# EasyEDA Pro project ProPrj_ftdi-jtag-xilinx_2025-03-20_v3.2.epro

# Schematic Schematic1
Board Name: Board1; Create Date: 2024-12-31; Page Name: FT2232HQ; Project Name: ftdi-jtag-xilinx; Schematic Name: Schematic1; Update Date: 2025-03-20; Company: 嘉立创EDA; Page Size: A4; Version: V1.0
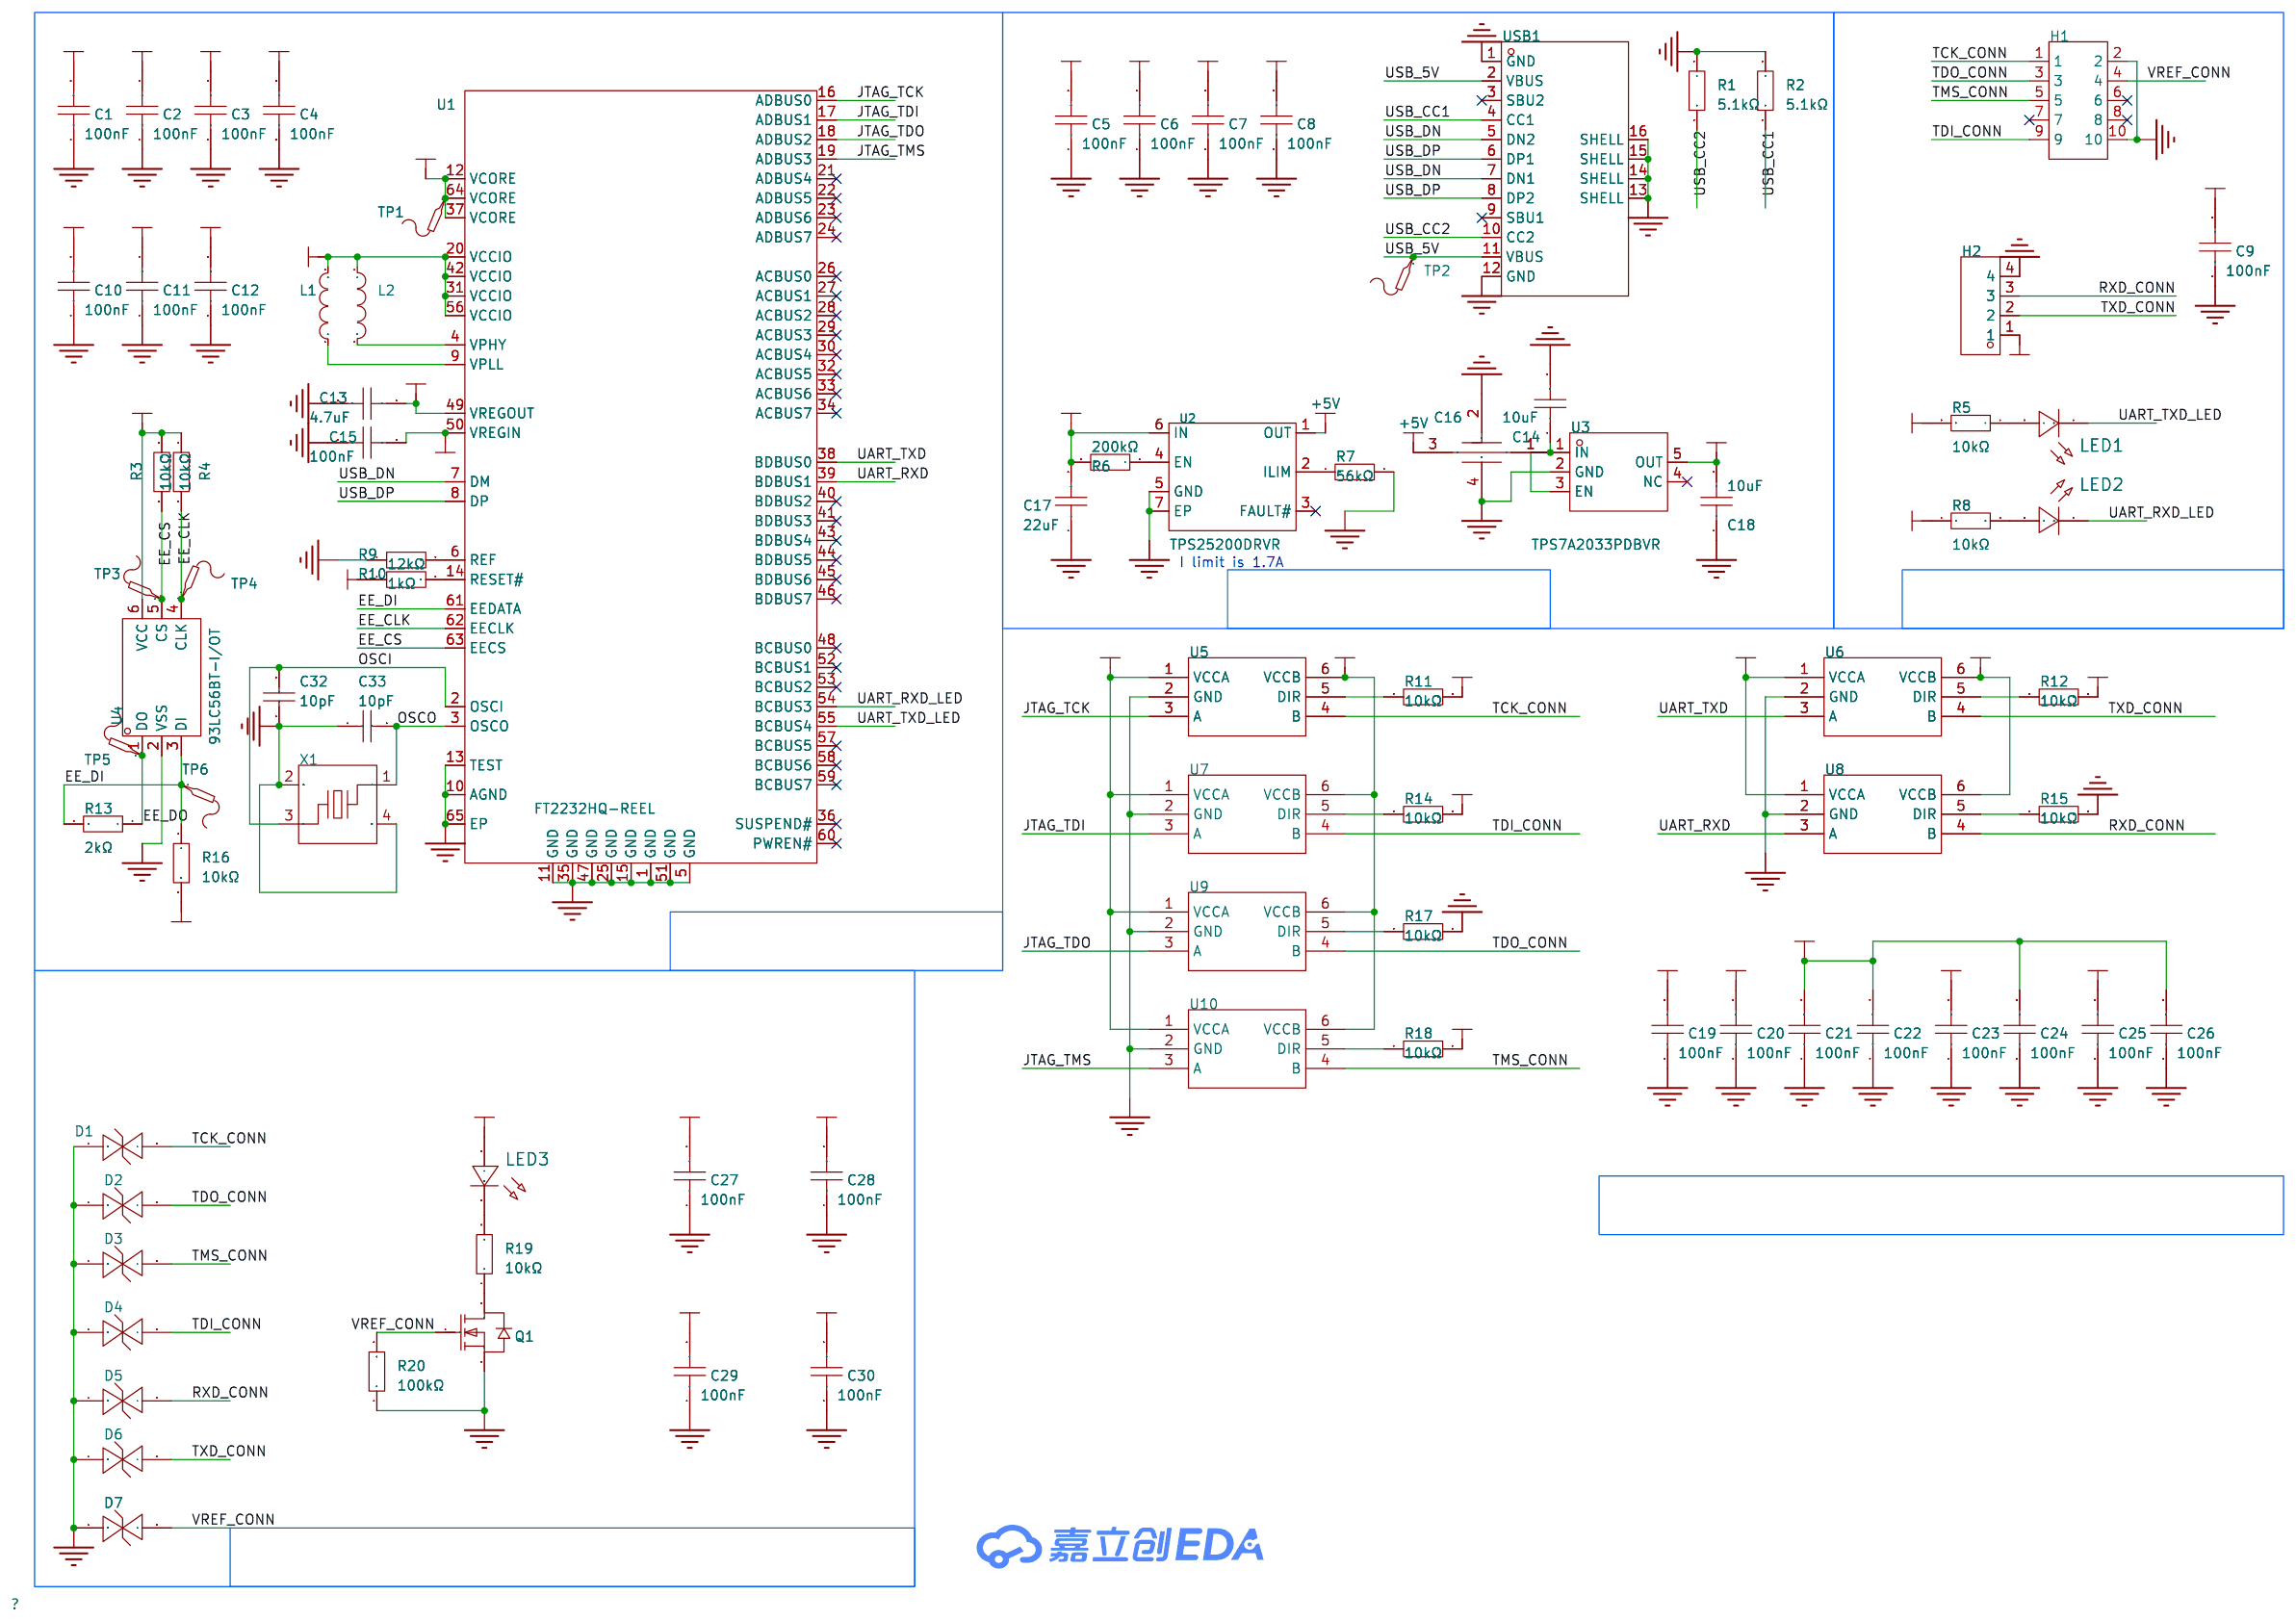
[diagram p0: schematic sheet]

## Parts
C1  100nF  [C0402]
C2  100nF  [C0402]
C3  100nF  [C0402]
C4  100nF  [C0402]
C5  100nF  [C0402]
C6  100nF  [C0402]
C7  100nF  [C0402]
C8  100nF  [C0402]
C9  100nF  [C0402]
C10  100nF  [C0402]
C11  100nF  [C0402]
C12  100nF  [C0402]
C13  4.7uF  [C0402]
C14  10uF  [C0603]
C15  100nF  [C0402]
C16  NFM21PC104R1E3D  [CAP-SMD_4P-L2.0-W1.25]
C17  22uF  [C0805]
C18  10uF  [C0603]
C19  100nF  [C0402]
C20  100nF  [C0402]
C21  100nF  [C0402]
C22  100nF  [C0402]
C23  100nF  [C0402]
C24  100nF  [C0402]
C25  100nF  [C0402]
C26  100nF  [C0402]
C27  100nF  [C0402]
C28  100nF  [C0402]
C29  100nF  [C0402]
C30  100nF  [C0402]
C32  10pF  [C0402]
C33  10pF  [C0402]
D1  H5VL10B  [SOD-882_L1.0-W0.6-BI]
D2  H5VL10B  [SOD-882_L1.0-W0.6-BI]
D3  H5VL10B  [SOD-882_L1.0-W0.6-BI]
D4  H5VL10B  [SOD-882_L1.0-W0.6-BI]
D5  H5VL10B  [SOD-882_L1.0-W0.6-BI]
D6  H5VL10B  [SOD-882_L1.0-W0.6-BI]
D7  H5VL10B  [SOD-882_L1.0-W0.6-BI]
H1  PZ254-2-05-Z-8.5  [卧贴 2x5P 2.54]
H2  PZ254V-11-04P  [HDR-TH_4P-P2.54-V-M]
L1  BLM15PD121SN1D  [L0402]
L2  BLM15PD121SN1D  [L0402]
LED1  NCD0603Y1  [LED0603-RD]
LED2  NCD0603Y1  [LED0603-RD]
LED3  NCD0603Y1  [LED0603-RD]
Q1  SI2302  [SOT-23-3_L2.9-W1.3-P1.90-LS2.4-BR]
R1  5.1kΩ  [R0402]
R2  5.1kΩ  [R0402]
R3  10kΩ  [R0402]
R4  10kΩ  [R0402]
R5  10kΩ  [R0402]
R6  200kΩ  [R0402]
R7  56kΩ  [R0402]
R8  10kΩ  [R0402]
R9  12kΩ  [R0402]
R10  1kΩ  [R0402]
R11  10kΩ  [R0402]
R12  10kΩ  [R0402]
R13  2kΩ  [R0402]
R14  10kΩ  [R0402]
R15  10kΩ  [R0402]
R16  10kΩ  [R0402]
R17  10kΩ  [R0402]
R18  10kΩ  [R0402]
R19  10kΩ  [R0402]
R20  100kΩ  [R0402]
TP1  -  [Test-Point-0.5mm]
TP2  -  [Test-Point-0.5mm]
TP3  -  [Test-Point-0.5mm]
TP4  -  [Test-Point-0.5mm]
TP5  -  [Test-Point-0.5mm]
TP6  -  [Test-Point-0.5mm]
U1  FT2232HQ-REEL  [QFN-64_L9.0-W9.0-P0.50-TL-EP4.3]
U2  TPS25200DRVR  [WSON-6_L2.0-W2.0-P0.65-TL-EP]
U3  TPS7A2033PDBVR  [SOT-23-5_L2.9-W1.6-P0.95-LS2.8-BR]
U4  93LC56BT-I/OT  [SOT-23-6_L2.9-W1.6-P0.95-LS2.8-BR]
U5  SN74LVC1T45DBVR  [SOT-23-6_L2.9-W1.6-P0.95-LS2.8-BR]
U6  SN74LVC1T45DBVR  [SOT-23-6_L2.9-W1.6-P0.95-LS2.8-BR]
U7  SN74LVC1T45DBVR  [SOT-23-6_L2.9-W1.6-P0.95-LS2.8-BR]
U8  SN74LVC1T45DBVR  [SOT-23-6_L2.9-W1.6-P0.95-LS2.8-BR]
U9  SN74LVC1T45DBVR  [SOT-23-6_L2.9-W1.6-P0.95-LS2.8-BR]
U10  SN74LVC1T45DBVR  [SOT-23-6_L2.9-W1.6-P0.95-LS2.8-BR]
USB1  TYPEC-302-BRP16SC16  [USB-C-SMD_TYPEC-302-BRP16SC16]
X1  12MHz  [CRYSTAL-SMD_4P-L2.5-W2.0-BL-A]

## Library data of the parts
C1-C12 C15 C19-C30 = CC0402KRX7R7BB104: 容值:100nF;精度:±10%;额定电压:16V;材质(温度系数):X7R;; LCSC Part Name: 100nF ±10% 16V; Supplier Part: C60474; Manufacturer: YAGEO(国巨); Supplier Footprint: 0402; JLCPCB Part Class: Extended Part; Datasheet: https://atta.szlcsc.com/upload/public/pdf/source/20211223/9278FD768280B81DDBEF48FA36411A03.pdf; Supplier: LCSC; Tolerance: ±10%; Voltage Rated: 16V; Temperature Coefficient: X7R
C13 = CL05A475KP5NRNC: 容值:4.7uF;精度:±10%;额定电压:10V;材质(温度系数):X5R;; LCSC Part Name: 4.7uF ±10% 10V; Supplier Part: C368809; Manufacturer: SAMSUNG(三星); Supplier Footprint: 0402; JLCPCB Part Class: Extended Part; Datasheet: https://atta.szlcsc.com/upload/public/pdf/source/20160218/1457707763339.pdf; Supplier: LCSC; Tolerance: ±10%; Voltage Rated: 10V; Temperature Coefficient: X5R
C14 C18 = CL10A106MA8NRNC: 容值:10uF;精度:±20%;额定电压:25V;材质(温度系数):X5R;; LCSC Part Name: 10uF ±20% 25V; Supplier Part: C96446; Manufacturer: SAMSUNG(三星); Supplier Footprint: 0603; JLCPCB Part Class: Basic Part; Datasheet: https://atta.szlcsc.com/upload/public/pdf/source/20160218/1457707763339.pdf; Supplier: LCSC; Tolerance: ±20%; Voltage Rated: 25V; Temperature Coefficient: X5R
C16 = NFM21PC104R1E3D: 电容量:100nF;精度:±20%;直流电阻:30mΩ;; LCSC Part Name: 100nF(104) ±20% 25V; Supplier Part: C86150; Manufacturer: muRata(村田); Supplier Footprint: 0805; JLCPCB Part Class: 扩展库; Datasheet: https://atta.szlcsc.com/upload/public/pdf/source/20180326/C86150_E4B7366323682FA84DED9003C68CA797.pdf; Supplier: LCSC; Nominal Capacitance: 100nF; CapacitanceTolerance: ±20%; DC Rated Voltage: 25V; Rated Current: 2A; DC Resistance: 30mΩ; Operating Temperature: -55℃~+125℃
C17 = CGA0805X5R226M350MT: 容值:22uF;精度:±20%;额定电压:35V;材质(温度系数):X5R;; LCSC Part Name: 22uF ±20% 35V; Supplier Part: C6119901; Manufacturer: HRE(芯声); Supplier Footprint: 0805; JLCPCB Part Class: Extended Part; Datasheet: https://atta.szlcsc.com/upload/public/pdf/source/20231129/D589D0CC4D260F7AC3A77E53B455CCB3.pdf; Supplier: LCSC; Tolerance: ±20%; Voltage Rated: 35V; Temperature Coefficient: X5R
C32 C33 = CC0402JRNPO9BN100: 容值:10pF;精度:±5%;额定电压:50V;材质(温度系数):NP0;; LCSC Part Name: 10pF ±5% 50V; Supplier Part: C106199; Manufacturer: YAGEO(国巨); Supplier Footprint: 0402; JLCPCB Part Class: 扩展库; Datasheet: https://atta.szlcsc.com/upload/public/pdf/source/20181008/C309499_21CC21451B82C39E3D92150FD6B30293.pdf; Supplier: LCSC; Tolerance: ±5%; Voltage Rated: 50V; Temperature Coefficient: NP0
D1-D7 = H5VL10B: 极性:双向;反向截止电压(Vrwm):5V;最大钳位电压:10V;峰值脉冲电流(Ipp):5A;峰值脉冲功率(Ppp):50W;击穿电压:5.6V;; LCSC Part Name: H5VL10B 丝印 PB; Supplier Part: C7420372; Manufacturer: 宏迦橙; Supplier Footprint: DFN1006-2L; JLCPCB Part Class: 扩展库; Datasheet: https://atta.szlcsc.com/upload/public/pdf/source/20230630/5024ECFEAD3C9801B07A8DBB967AB462.pdf; Supplier: LCSC; polarity: 双向; Reverse Stand-Off Voltage (Vrwm): 5V; Maximum Clamping Voltage: 10V; Peak Pulse Current (Ipp): 5A; Peak Pulse Power Dissipation (Ppp): 50W; Breakdown Voltage: 5.6V; Reverse Leakage Current (Ir): 100nA; Number of Lines: 单路; Operating Temperature: -55℃~+155℃; Type: ESD
H1 = PZ254-2-05-Z-8.5_C2894966: 插针结构:2x5P;间距:2.54mm;行距:2.54mm;圆针/方针:方针;安装方式:直插;排数:双排;总PIN位数:10P;额定电流:3A;额定电压:-;配合针长度:6mm;塑高:2.5mm;端接针长度:3mm;触头材质:黄铜;工作温度:-40℃~+105℃;颜色:黑色;; LCSC Part Name: 2x5P 间距:2.54mm 方针 直插; Supplier Part: C2894966; Manufacturer: HCTL(华灿天禄); Supplier Footprint: 插件,P=2.54mm; Datasheet: https://atta.szlcsc.com/upload/public/pdf/source/20230609/5BA09C8BEB9B31376F8BF6032FF67CAC.pdf; Supplier: LCSC; Pin Structure: 2x5P; Pitch: 2.54mm; Row Spacing: 2.54mm; Circluar Pins/Square Pins: 方针; Mounting Type: 直插; Number of Rows: 双排; Number of Pins: 10P; Current Rating: 3A; Length of Mating Pin: 6mm; Insulation Height: 2.5mm; Length of End Connection Pin: 3mm; Contact Material: 黄铜; Operating Temperature: -40℃~+105℃; Color: 黑色
H2 = PZ254V-11-04P: 插针结构:1x4P;间距:2.54mm;行距:-;圆针/方针:方针;安装类型:直插;排数:单排;总PIN位数:4P;额定电流:3A;额定电压:250V;配合针长度:6mm;塑高:2.5mm;端接针长度:3mm;触头材质:-;工作温度范围:-40℃~+105℃;颜色:黑色;; LCSC Part Name: 间距:2.54mm 1x4P 直插 方针; Supplier Part: C2691448; Manufacturer: XFCN(兴飞); Supplier Footprint: 插件,P=2.54mm; Datasheet: https://atta.szlcsc.com/upload/public/pdf/source/20200309/C492403_F9F19131791D08044AD4F84F8E751A34.pdf; Supplier: LCSC; Pin Structure: 1x4P; Pitch: 2.54mm; Circluar Pins/Square Pins: 方针; Mounting Type: 直插; Number of Rows: 单排; Number of Pins: 4P; Current Rating (Max): 3A; Voltage Rating (Max): 250V; Length of Mating Pin: 6mm; Insulation Height: 2.5mm; Length of End Connection Pin: 3mm; Operating Temperature Range: -40℃~+105℃; Color: 黑色
L1 L2 = BLM15PD121SN1D: 标称阻抗@测试频率:120Ω@100MHz;误差:±25%;直流电阻(RDC):90mΩ;; LCSC Part Name: 单路 0402磁珠 阻抗120Ω@100MHz; Supplier Part: C76891; Manufacturer: muRata(村田); Supplier Footprint: 0402; Datasheet: https://atta.szlcsc.com/upload/public/pdf/source/20180326/C76891_C89C2C1119D9992B67A2515C9BBB882D.pdf; Supplier: LCSC; Impedance @ Frequency: 120Ω@100MHz; Tolerance: ±25%; DC Resistance: 90mΩ; Current Rating: 1.3A; Circuits: 1
LED1-LED3 = NCD0603Y1: 发光颜色:黄色;正向电压(VF):1.6V~2.6V;功率:65mW;正向电流:20mA;主波长:586nm~595nm;透镜颜色:无色透明透镜;发光强度:80mcd~220mcd;发光角度:130°;工作温度:-30℃~+85℃;; Supplier Part: C84268; Manufacturer: 国星光电; Supplier Footprint: 0603; JLCPCB Part Class: Extended Part; Datasheet: https://atta.szlcsc.com/upload/public/pdf/source/20200820/C84268_8FC106CB292CF978F9CFC6892464F83C.pdf; Supplier: LCSC; Emitted Color: 黄色; Forward Voltage (VF): 1.6V~2.6V; Power Dissipation: 65mW; Forward Current: 20mA; Dominant Wavelength: 586nm~595nm; Lens Color: 无色透明透镜; Luminous Intensity: 80mcd~220mcd; Viewing Angle: 130°; Operating Temperature: -30℃~+85℃
Q1 = SI2302_C2891732: 类型:1个N沟道;漏源电压(Vdss):20V;连续漏极电流(Id):3A;导通电阻(RDS(on)):50mΩ@4.5V,3A;耗散功率(Pd):1W;阈值电压(Vgs(th)):1V;; LCSC Part Name: N沟道,电流:3A,耐压:20V; Supplier Part: C2891732; Manufacturer: YONGYUTAI(永裕泰); Supplier Footprint: SOT-23; JLCPCB Part Class: 扩展库; Datasheet: https://atta.szlcsc.com/upload/public/pdf/source/20210901/467BBA277A18343FF82D7D641AA41F7C.pdf; Supplier: LCSC; Type: 1个N沟道; Drain to Source Voltage: 20V; Current - Continuous Drain(Id): 3A; RDS(on): 50mΩ@4.5V,3A; Pd - Power Dissipation: 1W; Gate Threshold Voltage (Vgs(th)@Id): 1V; Input Capacitance(Ciss@Vds): 300pF@10V; Reverse Transfer Capacitance (Crss@Vds): 80pF@10V; Operating Temperature: -55℃~+150℃
R1 R2 = 0402WGF5101TCE: 电阻类型:厚膜电阻;阻值:5.1kΩ;精度:±1%;功率:62.5mW;最大工作电压:50V;温度系数:±100ppm/℃;; LCSC Part Name: 5.1kΩ ±1% 62.5mW 厚膜电阻; Supplier Part: C25905; Manufacturer: UNI-ROYAL(厚声); Supplier Footprint: 0402; JLCPCB Part Class: Basic Part; Datasheet: https://atta.szlcsc.com/upload/public/pdf/source/20200306/C422600_1E6D84923E4A46A82E41ADD87F860B5C.pdf; Supplier: LCSC; Type: 厚膜电阻; Tolerance: ±1%; Power(Watts): 62.5mW; Overload Voltage (Max): 50V; Temperature Coefficient: ±100ppm/℃; Operating Temperature Range: -55℃~+155℃
R3-R5 R8 R11 R12 R14-R19 = RC0402FR-0710KL: 电阻类型:厚膜电阻;阻值:10kΩ;精度:±1%;功率:62.5mW;最大工作电压:50V;温度系数:±100ppm/℃;; LCSC Part Name: 厚膜电阻 10kΩ ±1% 62.5mW; Supplier Part: C60490; Manufacturer: YAGEO(国巨); Supplier Footprint: 0402; JLCPCB Part Class: Extended Part; Datasheet: https://atta.szlcsc.com/upload/public/pdf/source/20170925/C131467_1506321478108990263.pdf; Supplier: LCSC; Type: 厚膜电阻; Tolerance: ±1%; Power(Watts): 62.5mW; Overload Voltage (Max): 50V; Temperature Coefficient: ±100ppm/℃; Operating Temperature Range: -55℃~+155℃
R6 = 0402WGF2003TCE: 电阻类型:厚膜电阻;阻值:200kΩ;精度:±1%;功率:62.5mW;最大工作电压:50V;温度系数:±100ppm/℃;; LCSC Part Name: 200kΩ ±1% 62.5mW 厚膜电阻; Supplier Part: C25764; Manufacturer: UNI-ROYAL(厚声); Supplier Footprint: 0402; JLCPCB Part Class: Basic Part; Datasheet: https://atta.szlcsc.com/upload/public/pdf/source/20200306/C422600_1E6D84923E4A46A82E41ADD87F860B5C.pdf; Supplier: LCSC; Type: 厚膜电阻; Tolerance: ±1%; Power(Watts): 62.5mW; Overload Voltage (Max): 50V; Temperature Coefficient: ±100ppm/℃; Operating Temperature Range: -55℃~+155℃
R7 = 0402WGF5602TCE: 电阻类型:厚膜电阻;阻值:56kΩ;精度:±1%;功率:62.5mW;最大工作电压:50V;温度系数:±100ppm/℃;; LCSC Part Name: 56kΩ ±1% 62.5mW 厚膜电阻; Supplier Part: C25796; Manufacturer: UNI-ROYAL(厚声); Supplier Footprint: 0402; JLCPCB Part Class: Extended Part; Datasheet: https://atta.szlcsc.com/upload/public/pdf/source/20200306/C422600_1E6D84923E4A46A82E41ADD87F860B5C.pdf; Supplier: LCSC; Type: 厚膜电阻; Tolerance: ±1%; Power(Watts): 62.5mW; Overload Voltage (Max): 50V; Temperature Coefficient: ±100ppm/℃; Operating Temperature Range: -55℃~+155℃
R9 = 0402WGF1202TCE: 电阻类型:厚膜电阻;阻值:12kΩ;精度:±1%;功率:62.5mW;最大工作电压:50V;温度系数:±100ppm/℃;; LCSC Part Name: 12kΩ ±1% 62.5mW 厚膜电阻; Supplier Part: C25752; Manufacturer: UNI-ROYAL(厚声); Supplier Footprint: 0402; JLCPCB Part Class: Basic Part; Datasheet: https://atta.szlcsc.com/upload/public/pdf/source/20200306/C422600_1E6D84923E4A46A82E41ADD87F860B5C.pdf; Supplier: LCSC; Type: 厚膜电阻; Tolerance: ±1%; Power(Watts): 62.5mW; Overload Voltage (Max): 50V; Temperature Coefficient: ±100ppm/℃; Operating Temperature Range: -55℃~+155℃
R10 = 0402WGF1001TCE: 电阻类型:厚膜电阻;阻值:1kΩ;精度:±1%;功率:62.5mW;最大工作电压:50V;温度系数:±100ppm/℃;; LCSC Part Name: 1kΩ ±1% 62.5mW 厚膜电阻; Supplier Part: C11702; Manufacturer: UNI-ROYAL(厚声); Supplier Footprint: 0402; JLCPCB Part Class: Basic Part; Datasheet: https://atta.szlcsc.com/upload/public/pdf/source/20200306/C422600_1E6D84923E4A46A82E41ADD87F860B5C.pdf; Supplier: LCSC; Type: 厚膜电阻; Tolerance: ±1%; Power(Watts): 62.5mW; Overload Voltage (Max): 50V; Temperature Coefficient: ±100ppm/℃; Operating Temperature Range: -55℃~+155℃
R13 = FRC0402F2001TS: 电阻类型:厚膜电阻;阻值:2kΩ;精度:±1%;功率:62.5mW;最大工作电压:50V;温度系数:±100ppm/℃;; LCSC Part Name: 2kΩ ±1% 62.5mW 厚膜电阻; Supplier Part: C2909344; Manufacturer: FOJAN(富捷); Supplier Footprint: 0402; JLCPCB Part Class: Extended Part; Datasheet: https://atta.szlcsc.com/upload/public/pdf/source/20211221/925EC7D7225764EE0046F22065062C87.pdf; Supplier: LCSC; Type: 厚膜电阻; Tolerance: ±1%; Power(Watts): 62.5mW; Overload Voltage (Max): 50V; Temperature Coefficient: ±100ppm/℃; Operating Temperature Range: -55℃~+155℃
R20 = 0402WGF1003TCE: 电阻类型:厚膜电阻;阻值:100kΩ;精度:±1%;功率:62.5mW;最大工作电压:50V;温度系数:±100ppm/℃;; LCSC Part Name: 100kΩ ±1% 62.5mW 厚膜电阻; Supplier Part: C25741; Manufacturer: UNI-ROYAL(厚声); Supplier Footprint: 0402; JLCPCB Part Class: 基础库; Datasheet: https://atta.szlcsc.com/upload/public/pdf/source/20200306/C422600_1E6D84923E4A46A82E41ADD87F860B5C.pdf; Supplier: LCSC; Type: 厚膜电阻; Tolerance: ±1%; Power(Watts): 62.5mW; Overload Voltage (Max): 50V; Temperature Coefficient: ±100ppm/℃; Operating Temperature Range: -55℃~+155℃
TP1-TP6 = Test-Point: Test Point 测试点; Check: false
U1 = FT2232HQ-REEL: 应用功能:USB转UART；USB转FIFO;接口协议:UART;供电电压:3V~3.6V;; Supplier Part: C193662; Manufacturer: FTDI(飞特帝亚); Supplier Footprint: QFN-64-EP(9x9); JLCPCB Part Class: 扩展库; Datasheet: https://atta.szlcsc.com/upload/public/pdf/source/20180530/C193662_F14B45A4B5271BE746E436B0F2E041EE.pdf; Supplier: LCSC; Applications Function: USB转UART；USB转FIFO; Protocol: UART; Supply Voltage: 3V~3.6V; Operating Temperature: -40℃~+85℃
U2 = TPS25200DRVR: TPS25200 具有过压钳位的 6.5V/2.8A 电子保险丝; Supplier: LCSC; Manufacturer: TI(德州仪器); Supplier Part: C128401; JLCPCB Part Class: 扩展库; Supplier Footprint: WSON-6-EP(2x2); Datasheet: https://www.ti.com/cn/lit/gpn/tps25200
U3 = TPS7A2033PDBVR: Supplier Part: C2862740; Manufacturer: TI(德州仪器); Supplier Footprint: SOT-23-5; JLCPCB Part Class: 扩展库; Datasheet: https://atta.szlcsc.com/upload/public/pdf/source/20230221/9B73099824E408F4B24BD95C528A27ED.pdf; Supplier: LCSC
U4 = 93LC56BT-I/OT: The Microchip 93LC56B device is a 2Kb Microwire (3-wire) Serial EEPROM with dedicated 16-bit memory organization and a voltage operation range of 2.5 - 5.5V.? Also available are the 93LC56A for dedicated 8-bit memory organization and the 93LC56C for hardw; Supplier Part: C190271; Manufacturer: MICROCHIP(美国微芯); Supplier Footprint: SOT-23-6; Datasheet: https://atta.szlcsc.com/upload/public/pdf/source/20180423/C190271_ABAD329DACFE2165969EA1B02E3F54C8.pdf; Supplier: LCSC
U5-U10 = SN74LVC1T45DBVR: 数据速率:420Mbps;电压(VCCA):1.65V~5.5V;电压(VCCB):1.65V~5.5V;电路数:1;每个电路通道数:1;; Supplier Part: C7843; Manufacturer: TI(德州仪器); Supplier Footprint: SOT-23-6; JLCPCB Part Class: 扩展库; Datasheet: https://www.ti.com/cn/lit/gpn/sn74lvc1t45; Supplier: LCSC; Channel Type: 双向; Data Rate: 420Mbps; Supply Voltage (VCCA): 1.65V~5.5V; Supply Voltage (VCCB): 1.65V~5.5V; Number of Circuits: 1; Channels per Circuit: 1; Output Type: 非反相；三态; Operating Temperature: -40℃~+85℃
USB1 = TYPEC-302-BRP16SC16: 连接器类型:Type-C;标准:USB 3.1;公母:母;端口数量:1;触点数量:16P;安装方式:沉板;额定电流 - 电源:5A;工作温度范围:-45℃~+85℃;焊接温度(最大值):260℃;; LCSC Part Name: Type-C 母 沉板; Supplier Part: C2835313; Manufacturer: XUNPU(讯普); Supplier Footprint: SMD; JLCPCB Part Class: 扩展库; Datasheet: https://atta.szlcsc.com/upload/public/pdf/source/20210629/C2835313_96CAAD9C15DFF4F1D03DDC0B4E6AD92A.pdf; Supplier: LCSC; Connector Type: Type-C; Standard: USB 3.1; Gender: 母; Number of Ports: 1; Number of Contacts: 16P; Mounting Style: 沉板; Current Rating - Power (Max): 5A; Operating Temperature Range: -45℃~+85℃; Soldering Temperature(Max): 260℃
X1 = X252012MMB4SI-24: 晶振类型:贴片晶振;频率:12MHz;常温频差:±10ppm;负载电容:10pF;频率稳定度:±20ppm;; LCSC Part Name: 12MHz ±10ppm 10pF; Supplier Part: C2896601; Manufacturer: YXC(扬兴晶振); Supplier Footprint: SMD2520-4P; Datasheet: https://atta.szlcsc.com/upload/public/pdf/source/20240329/8B53C0AFBC5BB264DFB5D72B3757797A.pdf; Supplier: LCSC; Type: 贴片晶振; Normal temperature Frequency Tolerance: ±10ppm; Load Capacitance: 10pF; Frequency Stability: ±20ppm; Operating Temperature: -40℃~+85℃

## Nets
3V3: C1.2 C2.2 C3.2 C4.2 C5.2 C6.2 C7.2 C8.2 C15.2 C18.2 C19.2 C20.2 C23.2 C25.2 C27.2 C29.2 L1.2 L2.1 LED3.2(A) R3.1 R4.1 R5.2 R8.1 R10.1 R11.2 R12.2 R14.2 R16.2 R18.2 U1.20(VCCIO) U1.31(VCCIO) U1.42(VCCIO) U1.50(VREGIN) U1.56(VCCIO) U3.5(OUT) U4.6(VCC) U5.1(VCCA) U6.1(VCCA) U7.1(VCCA) U8.1(VCCA) U9.1(VCCA) U10.1(VCCA)
+5V: C16.3(OUT) U2.1(OUT)
GND: C1.1 C2.1 C3.1 C4.1 C5.1 C6.1 C7.1 C8.1 C9.1 C10.1 C11.1 C12.1 C13.2 C14.2 C15.1 C16.2(GND) C16.4(GND) C17.1 C18.1 C19.1 C20.1 C21.1 C22.1 C23.1 C24.1 C25.1 C26.1 C27.1 C28.1 C29.1 C30.1 C32.1 C33.1 D1.1(C) D2.1(C) D3.1(C) D4.1(C) D5.1(C) D6.1(C) D7.1(C) H1.2 H1.10 H2.4 Q1.2(S) R1.1 R2.1 R7.2 R9.1 R15.2 R17.2 R20.1 U1.1(GND) U1.5(GND) U1.10(AGND) U1.11(GND) U1.13(TEST) U1.15(GND) U1.25(GND) U1.35(GND) U1.47(GND) U1.51(GND) U1.65(EP) U2.5(GND) U2.7(EP) U3.2(GND) U4.2(VSS) U5.2(GND) U6.2(GND) U7.2(GND) U8.2(GND) U9.2(GND) U10.2(GND) USB1.1(GND) USB1.12(GND) USB1.13(SHELL) USB1.14(SHELL) USB1.15(SHELL) USB1.16(SHELL) X1.2(GND) X1.4(GND)
EE_CLK: R4.2 TP4.1 U1.62(EECLK) U4.4(CLK)
EE_CS: R3.2 TP3.1 U1.63(EECS) U4.5(CS)
EE_DI: R13.2 R16.1 TP6.1 U1.61(EEDATA) U4.3(DI)
EE_DO: R13.1 TP5.1 U4.1(DO)
JTAG_TCK: U1.16(ADBUS0) U5.3(A)
JTAG_TDI: U1.17(ADBUS1) U7.3(A)
JTAG_TDO: U1.18(ADBUS2) U9.3(A)
JTAG_TMS: U1.19(ADBUS3) U10.3(A)
OSCI: C32.2 U1.2(OSCI) X1.3
OSCO: C33.2 U1.3(OSCO) X1.1
RXD_CONN: D5.2(A) H2.3 U8.4(B)
TCK_CONN: D1.2(A) H1.1 U5.4(B)
TDI_CONN: D4.2(A) H1.9 U7.4(B)
TDO_CONN: D2.2(A) H1.3 U9.4(B)
TMS_CONN: D3.2(A) H1.5 U10.4(B)
TXD_CONN: D6.2(A) H2.2 U6.4(B)
UART_RXD: U1.39(BDBUS1) U8.3(A)
UART_RXD_LED: LED2.1(C) U1.54(BCBUS3)
UART_TXD: U1.38(BDBUS0) U6.3(A)
UART_TXD_LED: LED1.1(C) U1.55(BCBUS4)
USB_5V: C17.2 R6.2 TP2.1 U2.6(IN) USB1.2(VBUS) USB1.11(VBUS)
USB_CC1: R2.2 USB1.4(CC1)
USB_CC2: R1.2 USB1.10(CC2)
USB_DN: U1.7(DM) USB1.5(DN2) USB1.7(DN1)
USB_DP: U1.8(DP) USB1.6(DP1) USB1.8(DP2)
VCORE: C10.2 C11.2 C12.2 C13.1 TP1.1 U1.12(VCORE) U1.37(VCORE) U1.49(VREGOUT) U1.64(VCORE)
VREF_CONN: C9.2 C21.2 C22.2 C24.2 C26.2 C28.2 C30.2 D7.2(A) H1.4 H2.1 Q1.1(G) R20.2 U5.6(VCCB) U6.6(VCCB) U7.6(VCCB) U8.6(VCCB) U9.6(VCCB) U10.6(VCCB)
$1N3333: L2.2 U1.4(VPHY)
$1N3334: L1.1 U1.9(VPLL)
$1N3341: R9.2 U1.6(REF)
$1N3343: R10.2 U1.14(RESET#)
$1N3540: R6.1 U2.4(EN)
$1N3543: R7.1 U2.2(ILIM)
$1N3546: C14.1 C16.1(IN) U3.1(IN) U3.3(EN)
$1N7583: LED2.2(A) R8.2
$1N18705: R11.1 U5.5(DIR)
$1N18713: R14.1 U7.5(DIR)
$1N18716: R18.1 U10.5(DIR)
$1N19227: R12.1 U6.5(DIR)
$1N19229: R15.1 U8.5(DIR)
$1N19829: R17.1 U9.5(DIR)
$1N22717: LED1.2(A) R5.1
$1N26100: Q1.3(D) R19.1
$1N26102: LED3.1(C) R19.2

Not connected (* = marked no-connect by the designer): H1 6* 7* 8*; U1 21(ADBUS4)* 22(ADBUS5)* 23(ADBUS6)* 24(ADBUS7)* 26(ACBUS0)* 27(ACBUS1)* 28(ACBUS2)* 29(ACBUS3)* 30(ACBUS4)* 32(ACBUS5)* 33(ACBUS6)* 34(ACBUS7)* 36(SUSPEND#)* 40(BDBUS2)* 41(BDBUS3)* 43(BDBUS4)* 44(BDBUS5)* 45(BDBUS6)* 46(BDBUS7)* 48(BCBUS0)* 52(BCBUS1)* 53(BCBUS2)* 57(BCBUS5)* 58(BCBUS6)* 59(BCBUS7)* 60(PWREN#)*; U2 3(FAULT#)*; U3 4(NC)*; USB1 3(SBU2)* 9(SBU1)*

## Notes on the sheet
- I limit is 1.7A
- USB & 3V3
- JTAG & UART
- FT2232HQ
- LEVEL SHIFTER & RESET
- VOLTAGE LEVEL SWITCH

# Board PCB1
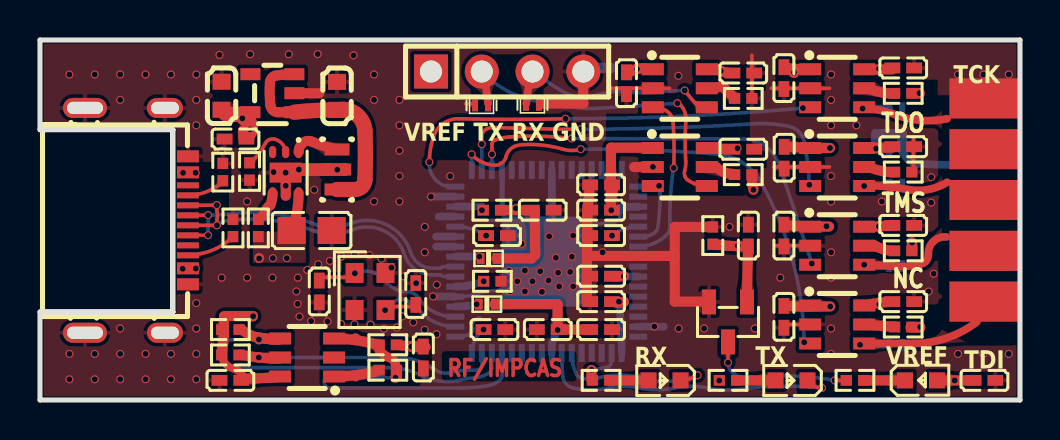
[diagram p1: board, top side]
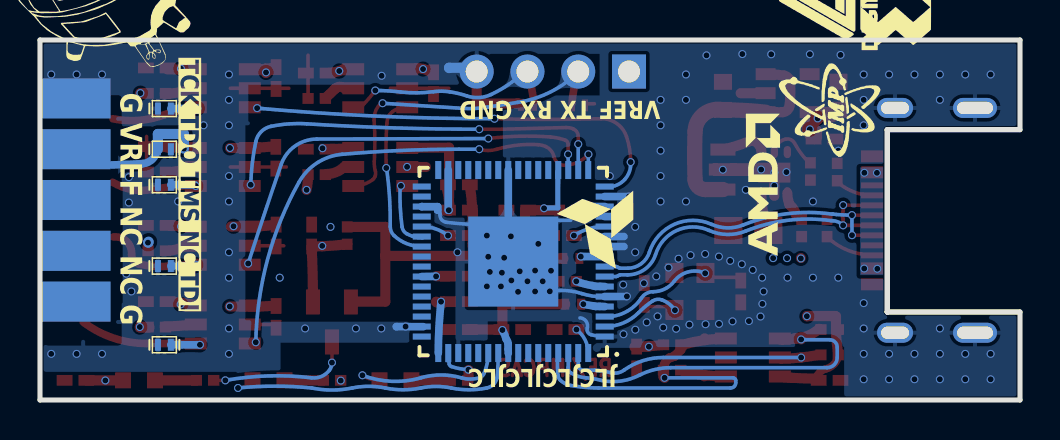
[diagram p2: board, bottom side, seen from below]

Outline 49.02 x 18 mm; copper layers: Top Layer, Inner1, Inner2, Bottom Layer. Coordinates in mm from the lower left corner of the outline.
Outline path: 0,18 49.02,18 49.02,0 0,0 0,4.4 6.64,4.4 6.64,13.52 0,13.52 0,18
Stack: Top Layer 0.035mm 外层铜厚1oz / Dielectric1 0.2104mm 7628 RC49% 8.6mil / Inner1 0.0152mm 内层铜厚 / Dielectric2 1.065mm 1.1mm H/HOZ Copper / Inner2 0.0152mm 内层铜厚 / Dielectric3 0.2104mm 7628 RC49% 8.6mil / Bottom Layer 0.035mm 外层铜厚1oz

## Design rules (mm)
net USB_DP: USB1
net USB_DN: USB1
template: 自定义配置
spacing copperThickness1oz (default): track to track 0.102, other pairs 0.152 to 0.3
spacing copperThickness2oz: track to track 0.203, other pairs 0.152 to 0.3
track width copperThickness1oz (default): min 0.127, default 0.178, max 2.54
track width copperThickness2oz: min 0.203, default 0.254, max 2.54
differential pair differentialPair (default): width min 0.127, default 0.254, max 2.54; gap min 0.152, default 0.152
via viaSize (default): diameter min 0.4, default 0.4, max 10; hole min 0.3, default 0.3, max 6.299

## Placement (name value [footprint] x y rotation side)
C1  100nF  [C0402]  28.07 6.19 0 top
C2  100nF  [C0402]  28.07 9.49 0 top
C3  100nF  [C0402]  19.18 2.12 90 top
C4  100nF  [C0402]  25.15 9.49 180 top
C5  100nF  [C0402]  29.34 15.84 90 top
C6  100nF  [C0402]  37.21 16.09 90 top
C7  100nF  [C0402]  47.24 0.98 180 top
C8  100nF  [C0402]  37.21 8.22 90 top
C9  100nF  [C0402]  43.18 4.92 180 top
C10  100nF  [C0402]  22.73 3.52 180 top
C11  100nF  [C0402]  28.07 8.22 0 top
C12  100nF  [C0402]  28.07 4.92 0 top
C13  4.7uF  [C0402]  22.86 8.22 0 top
C14  10uF  [C0603]  14.86 15.21 90 top
C15  100nF  [C0402]  9.78 13.05 0 top
C16  NFM21PC104R1E3D  [CAP-SMD_4P-L2.0-W1.25]  14.86 11.52 90 top
C17  22uF  [C0805]  13.59 8.48 180 top
C18  10uF  [C0603]  9.08 15.21 270 top
C19  100nF  [C0402]  9.53 0.98 0 top
C20  100nF  [C0402]  25.4 3.52 0 top
C21  100nF  [C0402]  43.18 8.73 180 top
C22  100nF  [C0402]  35.18 12.54 180 top
C23  100nF  [C0402]  37.23 12.11 90 top
C24  100nF  [C0402]  43.18 12.67 180 top
C25  100nF  [C0402]  37.21 4.16 90 top
C26  100nF  [C0402]  43.18 16.6 180 top
C27  100nF  [C0402]  28.07 10.76 0 top
C28  100nF  [C0402]  35.18 16.35 180 top
C29  100nF  [C0402]  28.07 3.52 180 top
C30  100nF  [C0402]  35.43 8.22 270 top
C32  10pF  [C0402]  18.8 5.3 270 top
C33  10pF  [C0402]  13.97 5.43 90 top
D1  H5VL10B  [SOD-882_L1.0-W0.6-BI]  42.8 14.57 180 bottom
D2  H5VL10B  [SOD-882_L1.0-W0.6-BI]  42.8 10.76 180 bottom
D3  H5VL10B  [SOD-882_L1.0-W0.6-BI]  42.8 6.7 180 bottom
D4  H5VL10B  [SOD-882_L1.0-W0.6-BI]  42.8 2.76 180 bottom
D5  H5VL10B  [SOD-882_L1.0-W0.6-BI]  24.63 14.76 180 top
D6  H5VL10B  [SOD-882_L1.0-W0.6-BI]  22.09 14.73 0 top
D7  H5VL10B  [SOD-882_L1.0-W0.6-BI]  42.8 12.54 0 bottom
H1  PZ254-2-05-Z-8.5  [卧贴 2x5P 2.54]  46.86 14.06 0 top
H2  PZ254V-11-04P  [HDR-TH_4P-P2.54-V-M]  23.37 16.42 0 top
L1  BLM15PD121SN1D  [L0402]  22.44 7.08 0 top
L2  BLM15PD121SN1D  [L0402]  22.35 4.79 180 top
LED1  NCD0603Y1  [LED0603-RD]  37.59 0.98 180 top
LED2  NCD0603Y1  [LED0603-RD]  31.24 0.98 180 top
LED3  NCD0603Y1  [LED0603-RD]  44.07 0.98 0 top
Q1  SI2302  [SOT-23-3_L2.9-W1.3-P1.90-LS2.4-BR]  34.42 3.9 90 top
R1  5.1kΩ  [R0402]  9.65 8.6 270 top
R2  5.1kΩ  [R0402]  9.14 11.4 270 top
R3  10kΩ  [R0402]  9.53 2.25 0 top
R4  10kΩ  [R0402]  9.53 3.52 0 top
R5  10kΩ  [R0402]  34.42 0.98 180 top
R6  200kΩ  [R0402]  10.92 8.6 270 top
R7  56kΩ  [R0402]  10.48 11.43 270 top
R8  10kΩ  [R0402]  28.07 0.98 0 top
R9  12kΩ  [R0402]  22.63 5.94 180 top
R10  1kΩ  [R0402]  22.61 9.49 180 top
R11  10kΩ  [R0402]  43.18 15.33 0 top
R12  10kΩ  [R0402]  35.18 11.27 0 top
R13  2kΩ  [R0402]  17.4 1.49 0 top
R14  10kΩ  [R0402]  43.18 3.65 0 top
R15  10kΩ  [R0402]  35.18 15.08 0 top
R16  10kΩ  [R0402]  17.4 2.76 0 top
R17  10kΩ  [R0402]  43.18 11.4 0 top
R18  10kΩ  [R0402]  43.18 7.46 0 top
R19  10kΩ  [R0402]  40.77 0.98 0 top
R20  100kΩ  [R0402]  33.66 8.22 270 top
TP1  -  [Test-Point-0.5mm]  29.21 4.92 0 top
TP2  -  [Test-Point-0.5mm]  10.96 7.1 0 top
TP3  -  [Test-Point-0.5mm]  10.95 2.14 0 top
TP4  -  [Test-Point-0.5mm]  10.95 3.03 0 top
TP5  -  [Test-Point-0.5mm]  15.79 1.18 0 top
TP6  -  [Test-Point-0.5mm]  15.78 3.09 0 top
U1  FT2232HQ-REEL  [QFN-64_L9.0-W9.0-P0.50-TL-EP4.3]  25.35 6.92 0 bottom
U2  TPS25200DRVR  [WSON-6_L2.0-W2.0-P0.65-TL-EP]  12.29 11.37 270 top
U3  TPS7A2033PDBVR  [SOT-23-5_L2.9-W1.6-P0.95-LS2.8-BR]  11.62 15.34 0 top
U4  93LC56BT-I/OT  [SOT-23-6_L2.9-W1.6-P0.95-LS2.8-BR]  13.36 2.13 0 top
U5  SN74LVC1T45DBVR  [SOT-23-6_L2.9-W1.6-P0.95-LS2.8-BR]  39.88 15.59 180 top
U6  SN74LVC1T45DBVR  [SOT-23-6_L2.9-W1.6-P0.95-LS2.8-BR]  32 11.65 180 top
U7  SN74LVC1T45DBVR  [SOT-23-6_L2.9-W1.6-P0.95-LS2.8-BR]  39.88 3.78 180 top
U8  SN74LVC1T45DBVR  [SOT-23-6_L2.9-W1.6-P0.95-LS2.8-BR]  32 15.59 180 top
U9  SN74LVC1T45DBVR  [SOT-23-6_L2.9-W1.6-P0.95-LS2.8-BR]  39.88 11.65 180 top
U10  SN74LVC1T45DBVR  [SOT-23-6_L2.9-W1.6-P0.95-LS2.8-BR]  39.88 7.71 180 top
USB1  TYPEC-302-BRP16SC16  [USB-C-SMD_TYPEC-302-BRP16SC16]  4.83 8.98 270 top
X1  12MHz  [CRYSTAL-SMD_4P-L2.5-W2.0-BL-A]  16.51 5.43 270 top

## Footprints (pads in the part's own frame, mm; a bottom-side part is the same pattern mirrored in y, then rotated)
C0402
  rect 0.79x0.54 smd: 1(-0.545,0) 2(0.545,0)
C0603
  rect 0.8x0.9 smd: 1(-0.7,0) 2(0.7,0)
C0805
  rect 1.41x1.35 smd: 1(-1,0) 2(1,0)
CAP-SMD_4P-L2.0-W1.25
  rect 0.6x1.25 smd: 1(-1,0) 3(1,0)
  rect 0.6x0.4 smd: 2(0,-0.508) 4(0,0.508)
CRYSTAL-SMD_4P-L2.5-W2.0-BL-A
  rect 1x0.9 smd: 1(-0.925,-0.775) 2(0.925,-0.775) 3(0.925,0.775) 4(-0.925,0.775)
HDR-TH_4P-P2.54-V-M
  rect 1.7x1.7 hole 1.1: 1(-3.81,0)
  round 1.7 hole 1.1: 2(-1.27,0) 3(1.27,0) 4(3.81,0)
L0402
  rect 0.4x0.55 smd: 1(-0.4,0) 2(0.4,0)
LED0603-RD
  rect 0.8x0.8 smd: 1(-0.799,0) 2(0.799,0)
QFN-64_L9.0-W9.0-P0.50-TL-EP4.3
  rect 0.9x0.3 smd: 1(-4.575,3.75) 2(-4.575,3.25) 3(-4.575,2.75) 4(-4.575,2.25) 5(-4.575,1.75) 6(-4.575,1.25) 7(-4.575,0.75) 8(-4.575,0.25) 9(-4.575,-0.25) 10(-4.575,-0.75) 11(-4.575,-1.25) 12(-4.575,-1.75) 13(-4.575,-2.25) 14(-4.575,-2.75) 15(-4.575,-3.25) 16(-4.575,-3.75) 33(4.575,-3.75) 34(4.575,-3.25) 35(4.575,-2.75) 36(4.575,-2.25) 37(4.575,-1.75) 38(4.575,-1.25) 39(4.575,-0.75) 40(4.575,-0.25) 41(4.575,0.25) 42(4.575,0.75) 43(4.575,1.25) 44(4.575,1.75) 45(4.575,2.25) 46(4.575,2.75) 47(4.575,3.25) 48(4.575,3.75)
  rect 0.3x0.9 smd: 17(-3.75,-4.575) 18(-3.25,-4.575) 19(-2.75,-4.575) 20(-2.25,-4.575) 21(-1.75,-4.575) 22(-1.25,-4.575) 23(-0.75,-4.575) 24(-0.25,-4.575) 25(0.25,-4.575) 26(0.75,-4.575) 27(1.25,-4.575) 28(1.75,-4.575) 29(2.25,-4.575) 30(2.75,-4.575) 31(3.25,-4.575) 32(3.75,-4.575) 49(3.75,4.575) 50(3.25,4.575) 51(2.75,4.575) 52(2.25,4.575) 53(1.75,4.575) 54(1.25,4.575) 55(0.75,4.575) 56(0.25,4.575) 57(-0.25,4.575) 58(-0.75,4.575) 59(-1.25,4.575) 60(-1.75,4.575) 61(-2.25,4.575) 62(-2.75,4.575) 63(-3.25,4.575) 64(-3.75,4.575)
  rect 4.5x4.5 smd: 65(0,-0.001)
R0402
  rect 0.566x0.54 smd: 1(-0.433,0) 2(0.433,0)
SOD-882_L1.0-W0.6-BI
  rect 0.3x0.6 smd: 1(-0.325,0) 2(0.325,0)
SOT-23-3_L2.9-W1.3-P1.90-LS2.4-BR
  rect 1.25x0.7 smd: 1(1,-0.95) 2(1,0.95) 3(-1,0)
SOT-23-5_L2.9-W1.6-P0.95-LS2.8-BR
  rect 1x0.6 smd: 1(1.1,-0.95) 2(1.1,0) 3(1.1,0.95) 4(-1.1,0.95) 5(-1.1,-0.95)
SOT-23-6_L2.9-W1.6-P0.95-LS2.8-BR
  rect 1.1x0.6 smd: 1(1.35,-0.95) 2(1.35,0) 3(1.35,0.95) 4(-1.35,0.95) 5(-1.35,0) 6(-1.35,-0.95)
Test-Point-0.5mm
  round 0.5 smd: 1(0,0)
USB-C-SMD_TYPEC-302-BRP16SC16
  rect 0.6x1.1 smd: 1(-3.2,2.575) 2(-2.4,2.575) 11(2.4,2.575) 12(3.2,2.575)
  rect 0.3x1.1 smd: 3(-1.75,2.575) 4(-1.25,2.575) 5(-0.75,2.575) 6(-0.25,2.575) 7(0.25,2.575) 8(0.75,2.575) 9(1.25,2.575) 10(1.75,2.575)
  oval 1x1.8 hole 0.61x1.4: 13(-5.62,1.425) 14(5.62,1.425)
  oval 1x2.2 hole 0.61x1.8: 15(-5.62,-2.575) 16(5.62,-2.575)
WSON-6_L2.0-W2.0-P0.65-TL-EP
  oval 0.607x0.364 smd: 1(-1.028,0.65) 2(-1.028,0) 3(-1.028,-0.65) 4(1.028,-0.65) 5(1.028,0) 6(1.028,0.65)
  rect 1x1.6 smd: 7(0,0)
卧贴 2x5P 2.54
  rect 3.5x2 smd: 1(0.381,1.016) 3(0.381,-1.524) 5(0.381,-4.064) 7(0.381,-6.604) 9(0.381,-9.144)
  rect 3.5x2 smd far side: 2(0.381,1.016) 4(0.381,-1.524) 6(0.381,-4.064) 8(0.381,-6.604) 10(0.381,-9.144)

## Nets
As in the schematic.

Pads without a net: H1 6 7 8; U1 21 22 23 24 26 27 28 29 30 32 33 34 36 40 41 43 44 45 46 48 52 53 57 58 59 60; U2 3; U3 4; USB1 3 9

## Via types
v1: diameter 0.4, hole 0.3, Top Layer to Bottom Layer, 202 vias

## Routing (per net, layer and track width the routed paths; a pad name or vN(x,y) marks a point on that pad's centre or on a via; arc(x,y) is an arc through that point)
3V3: length 53.2
  Top Layer w0.178: v1(37.72,16.38) arc(37.72,16.47) 37.76,16.55 ; 37.76,16.55 arc(37.77,16.55) 37.77,16.56 ; 37.76,16.55 arc(37.76,16.55) 37.75,16.56 arc(37.75,16.56) 37.75,16.56 arc(37.76,16.58) 37.77,16.56 ; 37.76,16.55 arc(37.77,16.56) 37.77,16.56
  Top Layer w0.381: 10.22,1.06 arc(10.02,1.38) 9.69,1.56 arc(9.24,1.87) 9.06,2.38
  Top Layer w0.508: 43.54,3.62 44.03,3.62 44.03,3.66 ; 27.58,1.49 27.59,1.49 27.59,0.99 ; v1(44,15.34) 44,15.33 R11.2 ; R10.1 24.76,9.49 24.77,7.26 24.59,7.08 L1.2 ; 38.53,4.68 v1(39.53,4.68) ; L2.1 25.89,4.79 25.89,3.52 ; 46.7,0.98 LED3.2 ; R18.2 43.62,7.46 v1(43.62,7.87) ; 10.65,4.18 10.65,4.2 9.27,4.2 9.27,4.18 9.21,4.18 9.21,3.28 ; 25.89,3.52 C29.2 27.63,3.52 ; 25.89,3.52 v1(25.89,3.5) ; 28.56,10.11 28.56,12.62 30.55,12.62 ; 28.59,6.19 29.21,6.19 ; 38.5,12.61 arc(37.89,12.63) 37.28,12.7 ; 37.25,4.72 arc(37.88,4.68) 38.51,4.67 ; 37.75,16.56 arc(37.74,16.56) 37.72,16.56 arc(37.53,16.58) 37.34,16.6 ; 28.54,9.45 arc(28.58,10.06) 28.69,10.67 ; 37.72,16.35 arc(37.65,16.47) 37.75,16.56 arc(37.76,16.56) 37.77,16.56 arc(38.18,16.53) 38.58,16.52 ; R12.2 arc(35.63,10.89) v1(35.69,10.51) ; v1(39.52,12.6) arc(38.88,12.59) 38.25,12.54 ; 10.22,1.07 arc(10.82,1.08) 11.42,1.11 arc(11.62,1.12) 11.81,1.13 ; 38.53,8.67 arc(37.94,8.69) 37.34,8.75 ; 19.29,2.65 arc(18.93,2.66) 18.56,2.67 ; 9.2,3.51 arc(9.17,2.91) 9.09,2.31 ; 29.33,16.25 arc(29.57,16.44) 29.86,16.56 arc(30.21,16.59) 30.55,16.51 ; R16.2 arc(18.2,2.72) 18.56,2.69 arc(18.87,2.67) C3.2 ; 39.47,8.67 arc(39.05,8.68) 38.63,8.69
  Top Layer w0.762: 10.22,14.28 9.42,14.28 arc(9.26,14.34) 9.19,14.5 ; 10.22,14.28 10.39,14.28 ; 10.22,14.28 arc(10.34,14.19) 10.22,14.1 ; 10.22,14.28 arc(10.18,14.28) 10.15,14.29 arc(10.11,14.29) 10.08,14.29 ; 10.37,13.36 arc(10.49,13.41) v1(10.51,13.54) arc(10.47,13.87) 10.22,14.1 ; 10.36,13.36 arc(10.38,13.24) 10.28,13.17 ; 10.36,13.36 arc(10.32,13.38) 10.28,13.41 ; 10.36,13.36 arc(10.36,13.37) 10.35,13.38 arc(10.32,13.4) 10.28,13.41 ; 10.22,14.1 arc(10.22,14.1) 10.22,14.1
  Bottom Layer w0.178: 28.62,2.37 arc(28.6,2.08) 28.55,1.79 arc(28.51,1.72) 28.45,1.68 arc(28.06,1.57) 27.66,1.52
  Bottom Layer w0.254: 23.79,9.6 23.12,9.6 23.12,11.42
  Bottom Layer w0.381: v1(28.57,9.49) 28.6,9.49 U1.31 ; U1.56 arc(25.6,2.44) 25.61,2.53 25.61,2.8 arc(25.63,2.92) 25.7,3.03 arc(25.78,3.27) v1(25.89,3.5) ; U1.42 arc(29.59,6.18) 29.26,6.18 arc(29.23,6.18) v1(29.21,6.18)
  Bottom Layer w0.508: 43.61,7.87 arc(43.61,7.88) 43.6,7.89 arc(43.59,7.9) 43.59,7.91
  vias: v1(10.12,14.08) v1(10.66,4.19) v1(18.56,2.67) v1(23.81,9.59) v1(27.59,1.51) v1(29.86,16.55) v1(33.98,0.97) v1(39.34,8.69) v1(44.03,3.65) v1(45.75,0.98)
+5V: length 2.3
  Top Layer w0.508: U2.1 arc(12.97,12.61) 13.08,12.79 arc(13.31,12.94) 13.59,12.92 arc(14.22,12.69) C16.3
GND: length 72.6
  Top Layer w0.178: 21.75,14.81 21.29,14.81 ; R17.2 43.69,11.4 43.69,13.17 ; 36.58,15.59 U5.2 39.5,15.59 ; R15.2 35.61,17.24 ; U7.2 37.21,3.78 C25.1 ; 31.5,15.59 U8.2 28.57,15.59 ; 39.5,11.65 U9.2 36.7,11.65 ; U10.2 36.83,7.71
  Top Layer w0.508: 12.29,10.21 v1(12.29,10.71) 12.29,11.17 12.25,11.17 ; U3.2 13.97,15.34 ; 31.75,7.2 31.75,4.92 33.47,4.92 33.47,4.9 ; 31.75,7.2 27.36,7.2 ; 31.75,7.2 31.75,8.65 R20.1 ; v1(30.66,11.66) 30.66,11.65 29.72,11.65 ; 27.37,7.84 27.37,8.75 ; 27.37,7.84 27.37,7.68 ; 27.37,7.84 arc(27.37,7.52) 27.36,7.2 ; 27.37,8.75 27.37,9.45 ; 27.37,8.75 arc(27.38,9.12) 27.39,9.5 arc(27.44,10.13) C27.1 ; 27.36,7.2 arc(27.35,6.7) 27.35,6.19 arc(27.34,5.55) 27.34,4.9 ; 25.11,14.84 25.12,14.83 27.18,14.83 27.18,16.6
  Top Layer w0.635: 12.95,11.53 v1(12.95,11.52) C16.4 15.23,11.52 15.24,11.53
  Bottom Layer w0.178: 25.35,6.95 U1.65 ; 25.35,6.95 25.35,8.98 22.48,8.98 ; 25.35,6.95 arc(24.76,7.44) v1(24.1,7.81) ; 22.01,4.11 arc(21.71,3.94) 21.65,3.6 arc(21.62,3.39) 21.46,3.27 arc(21.12,3.2) U1.1 ; 29.12,9.49 arc(29.03,9.41) 29.01,9.29 arc(28.94,9.02) 28.7,8.89 arc(28.02,8.82) 27.33,8.78 ; 20.83,5.16 arc(21.38,5.2) 21.93,5.32 arc(22.69,5.47) 23.46,5.45 ; U1.25 arc(25.57,9.84) v1(25.47,8.18)
  Bottom Layer w0.381: U1.10 19.81,7.67 ; U1.11 19.81,8.17 ; U1.25 25.6,8.18 ; U1.13 19.94,9.17 ; U1.35 29.92,9.67 29.13,9.67 29.13,9.49 29.12,9.49 ; 29.86,3.67 31.2,3.67 31.2,3.67 ; U1.5 19.69,5.17 ; U1.15 v1(19.56,10.17)
  Bottom Layer w0.508: 28.56,16.6 28.56,16.61 27.24,16.61
  vias: v1(1.47,16.28) v1(1.47,2.31) v1(1.47,1.04) v1(2.74,16.28) v1(2.74,2.31) v1(2.74,1.04) v1(4.01,16.28) v1(4.01,15.01) v1(4.01,3.58) v1(4.01,2.31) v1(4.01,1.04) v1(5.28,16.28) v1(5.28,2.31) v1(5.28,1.04) v1(6.55,16.28) v1(6.55,2.31) v1(6.55,1.04) v1(7.82,16.28) v1(7.82,15.01) v1(7.82,13.74) v1(7.82,4.85) v1(7.82,3.58) v1(7.82,2.31) v1(7.82,1.04) v1(8.98,17.25) v1(9.09,12.47) v1(9.09,6.12) v1(10.36,9.93) v1(10.36,6.12) v1(10.51,17.29) v1(11.63,6.12) v1(11.68,11.4) v1(12.29,11.37) v1(12.45,17.29) v1(12.83,5.43) v1(12.9,6.12) v1(12.89,4.81) v1(12.98,4.17) v1(13.37,6.5) v1(13.56,3.95) v1(13.72,10.51) v1(13.89,17.3) v1(13.91,6.79) v1(14.38,3.93) v1(14.5,6.95) v1(14.87,11.51) v1(15.06,7.17) v1(15.06,3.81) v1(15.68,17.23) v1(15.75,7.3) v1(15.73,3.79) v1(16.48,7.24) v1(16.54,3.77) v1(16.71,16.28) v1(16.71,15.01) v1(16.71,9.93) v1(17.08,7.06) v1(17.2,3.56) v1(17.58,6.62) v1(17.85,3.62) v1(17.98,15.01) v1(17.98,13.74) v1(17.98,12.47) v1(17.98,11.2) v1(17.98,9.93) v1(18.13,4.18) v1(18.19,6.18) v1(18.67,3.88) v1(18.81,5.84) v1(19.25,8.66) v1(19.25,7.39) v1(19.24,3.51) v1(19.66,5.18) v1(19.85,5.77) v1(19.83,3.29) v1(20.52,11.2) v1(23.46,6.46) v1(23.52,5.43) v1(23.88,5.94) v1(24.26,6.47) v1(24.26,5.43) v1(24.64,5.94) v1(25.02,6.43) v1(25.11,5.41) v1(25.44,5.98) v1(25.8,7.11) v1(25.92,6.37) v1(25.97,5.68) v1(26.52,6.4) v1(26.67,8.22) v1(26.6,7.16) v1(26.67,5.68) v1(28.14,7.39) v1(30.73,3.67) v1(31.93,16.21) v1(31.95,3.58) v1(33.22,3.58) v1(34.49,8.66) v1(35.76,3.58) v1(37.03,6.12) v1(39.57,16.28) v1(39.57,15.01) v1(39.57,13.74) v1(39.57,11.2) v1(39.57,9.93) v1(39.57,7.39) v1(39.57,6.12) v1(39.57,3.58) v1(39.57,2.31) v1(40.84,13.74) v1(42.11,9.93) v1(44.45,5.43) v1(44.58,11.14) v1(44.58,9.87) v1(44.7,6.32) v1(45.92,16.28) v1(45.92,2.31) v1(47.19,16.28) v1(47.19,2.31) v1(48.46,16.28) v1(48.46,2.31)
EE_CLK: length 19.7
  Top Layer w0.508: 11.95,3.01 arc(11.59,3.03) 11.23,3.08 ; 11.23,3.08 arc(11.27,3.08) 11.32,3.08 ; 11.23,3.08 arc(11.1,3.1) 10.98,3.13 ; 11.23,3.08 arc(11.1,3.09) 10.97,3.11 arc(10.48,3.27) 10.05,3.56
  Bottom Layer w0.178: v1(10.95,3.03) arc(10.95,3.02) 10.94,3.01 9.53,3.01 arc(9.26,2.9) 9.14,2.63 9.14,2.12 arc(9.29,1.77) 9.65,1.62 17.46,1.62 arc(18.28,1.52) 19.05,1.24 arc(19.92,0.95) 20.84,0.96 arc(20.9,0.97) 20.95,0.98 arc(21.33,1.06) 21.72,1.11 arc(22.11,1.19) 22.48,1.36 arc(22.58,1.47) 22.61,1.62 arc(22.59,1.98) U1.62
EE_CS: length 14
  Top Layer w0.508: 10.04,2.26 arc(10.49,2.18) v1(10.95,2.12) arc(11.46,2.08) 11.97,2.07
  Bottom Layer w0.178: 10.92,2.12 17.84,2.12 arc(18.87,1.96) 19.81,1.49 arc(20.12,1.36) 20.45,1.36 arc(20.86,1.44) 21.27,1.49 21.84,1.49 arc(22.02,1.56) 22.1,1.74 U1.63
EE_DI: length 18.3
  Top Layer w0.457: 16.96,2.79 16.96,2.51 17.23,2.24 arc(17.25,2.21) 17.28,2.18 arc(17.31,2.18) 17.33,2.18 arc(17.42,2.13) 17.53,2.11 arc(17.73,1.92) 17.82,1.66 ; 17.28,2.2 arc(17.29,2.19) 17.3,2.18
  Top Layer w0.508: v1(17.78,1.11) 17.83,1.16 R13.2 ; 14.77,3.06 arc(15.27,3.04) 15.76,2.99 arc(16.33,2.9) 16.89,2.75
  Bottom Layer w0.178: v1(17.78,1.11) 14.36,1.11 arc(14.26,1.07) 14.22,0.97 14.22,0.86 arc(14.3,0.68) 14.48,0.6 21.08,0.6 arc(21.78,0.63) 22.48,0.73 arc(22.75,0.82) 22.99,0.98 arc(23.07,1.1) 23.11,1.24 arc(23.14,1.79) U1.61
EE_DO: length 2.2
  Top Layer w0.508: 14.63,1.17 arc(15.21,1.19) 15.79,1.24 arc(16.3,1.32) 16.81,1.42
JTAG_TCK: length 22.1
  Top Layer w0.178: v1(26.29,14.06) arc(23.62,14.03) 20.95,14.06 arc(20.17,13.83) 19.69,13.17 arc(19.53,12.54) v1(19.48,11.9)
  Bottom Layer w0.178: 20.62,10.65 arc(20.16,10.75) 19.78,11.02 arc(19.53,11.43) v1(19.48,11.9) ; v1(26.29,14.06) arc(32.23,14.2) v1(38.16,14.59)
JTAG_TDI: length 24.8
  Top Layer w0.178: 21.62,12.24 arc(22.13,11.89) 22.72,11.73 arc(23.1,11.84) 23.31,12.17 arc(23.46,12.48) 23.74,12.68 arc(23.92,12.74) 24.11,12.77 arc(25.14,12.74) 26.16,12.54 arc(26.61,12.48) v1(27.05,12.54)
  Bottom Layer w0.178: v1(27.05,12.54) 28.07,12.54 arc(30.99,12.48) 33.91,12.29 arc(35.16,11.85) 36.07,10.89 arc(37.64,7.02) v1(38.23,2.89) ; U1.17 arc(21.6,11.89) v1(21.59,12.29)
JTAG_TDO: length 20.6
  Top Layer w0.178: v1(22.1,12.79) 22.1,13.17 arc(22.17,13.4) 22.35,13.56 arc(22.53,13.61) 22.71,13.62 25.9,13.54 v1(27.05,13.54)
  Bottom Layer w0.178: U1.18 v1(22.1,12.79) ; v1(27.05,13.54) arc(31.37,13.61) 35.69,13.81 arc(36.58,13.81) 37.47,13.68 arc(37.96,13.41) 38.23,12.92 arc(38.4,11.85) v1(38.48,10.76)
JTAG_TMS: length 21.6
  Top Layer w0.178: v1(22.61,12.29) 22.61,12.79 arc(22.64,12.91) 22.74,12.99 arc(23.1,13.1) 23.48,13.15 arc(25.04,13.19) v1(26.6,13.07)
  Bottom Layer w0.178: v1(26.6,13.07) 35.18,13.05 arc(36.27,12.7) 36.96,11.78 arc(37.8,9.31) v1(38.61,6.82) ; U1.19 arc(22.6,11.89) v1(22.61,12.29)
OSCI: length 5.5
  Top Layer w0.178: 18.7,4.67 17.34,4.67 17.34,4.68
  Bottom Layer w0.178: v1(17.26,4.49) arc(17.55,4.8) 17.91,5.01 arc(18.16,5.03) 18.38,4.95 arc(18.74,4.68) 19.08,4.37 arc(19.84,3.85) 20.74,3.67
OSCO: length 7.3
  Top Layer w0.178: 13.97,6.13 15.51,6.13 15.51,6.06
  Bottom Layer w0.178: 20.7,4.16 arc(19.7,4.41) 18.93,5.1 arc(18.68,5.33) 18.35,5.42 arc(17.76,5.55) 17.3,5.94 arc(16.59,6.41) 15.74,6.34
  vias: v1(15.75,6.34)
RXD_CONN: length 10.8
  Top Layer w0.178: 33.04,14.57 arc(32.63,15.01) 32.25,15.48
  Top Layer w0.381: 24.33,14.82 arc(24.43,15.6) 24.64,16.35
  Bottom Layer w0.178: 32.24,15.48 arc(31.61,15.45) 30.97,15.4 arc(30.16,15.36) 29.35,15.42 arc(28.93,15.44) 28.52,15.41 arc(28.09,15.32) 27.67,15.2 arc(27.06,15.12) 26.46,15.27 arc(25.52,15.82) 24.7,16.51
  vias: v1(32.25,15.48)
TCK_CONN: length 5.7
  Top Layer w0.381: 41.12,14.57 arc(41.97,14.49) 42.79,14.27 arc(44.07,13.98) 45.37,14.06
  Bottom Layer w0.381: D1.2 v1(41.15,14.57)
TDI_CONN: length 7.3
  Top Layer w0.381: U7.4 43.69,2.83 arc(45.36,3.1) 46.86,3.9
  Bottom Layer w0.381: D4.2 v1(41.02,2.76)
TDO_CONN: length 5.6
  Top Layer w0.381: 45.38,10.89 arc(44.45,10.53) 43.45,10.52 arc(42.28,10.67) 41.1,10.73
  Bottom Layer w0.381: D2.2 41.28,10.76
  vias: v1(41.23,10.7)
TMS_CONN: length 6.1
  Top Layer w0.381: v1(41.23,6.76) arc(41.89,6.75) 42.54,6.7 arc(43.32,6.68) 44.08,6.8 arc(44.35,6.98) 44.44,7.29 arc(44.69,7.93) 45.34,8.15
  Bottom Layer w0.381: D3.2 41.28,6.7
TXD_CONN: length 16.9
  Top Layer w0.178: U6.4 arc(32.84,10.78) 32.38,11.02 arc(32.31,11.09) 32.26,11.19 arc(32.23,11.33) 32.25,11.47 arc(32.3,11.7) 32.3,11.93 arc(32.27,12.95) 32.31,13.98 arc(32.22,14.48) 31.91,14.88
  Top Layer w0.381: 22.41,14.82 arc(22.31,15.6) 22.1,16.35
  Bottom Layer w0.178: 31.86,14.84 27.92,14.59 arc(27.28,14.58) 26.65,14.64 25.12,14.88 arc(23.48,15.41) 22.08,16.42
  vias: v1(31.88,14.84)
UART_RXD: length 8.7
  Top Layer w0.178: 30.57,14.67 arc(31,14.61) 31.38,14.42 arc(31.48,14.34) 31.55,14.25 arc(31.63,14.05) 31.67,13.84 arc(31.72,12.71) 31.7,11.59
  Bottom Layer w0.178: U1.39 arc(30.67,7.81) 31.31,8.22 arc(31.45,8.42) 31.5,8.67 arc(31.54,10.13) 31.68,11.59
  vias: v1(31.7,11.6)
UART_RXD_LED: length 8.2
  Top Layer w0.178: LED2.1 arc(32.49,1.05) v1(32.89,1.24)
  Bottom Layer w0.178: U1.54 arc(26.65,1.85) 26.8,1.36 arc(26.89,1.2) 27.05,1.11 arc(27.5,1.05) 27.94,1.11 arc(28.96,1.25) 29.97,1.11 arc(31.44,0.94) v1(32.89,1.24)
UART_TXD: length 3.3
  Bottom Layer w0.178: 29.87,8.11 arc(30.12,8.13) 30.36,8.18 arc(30.52,8.24) 30.68,8.31 arc(30.83,8.46) 30.91,8.66 arc(31,9.65) 31.01,10.65
  vias: v1(30.97,10.71)
UART_TXD_LED: length 15.4
  Top Layer w0.178: LED1.1 arc(38.49,0.86) 38.62,0.76 arc(38.86,0.64) v1(39.12,0.6)
  Bottom Layer w0.178: U1.55 arc(26.11,1.73) 26.16,1.11 arc(26.34,0.78) 26.67,0.6 arc(27.56,0.51) 28.45,0.6 arc(29.21,0.68) 29.97,0.6 arc(30.86,0.51) 31.75,0.6 arc(32.58,0.68) 33.4,0.6 arc(34.42,0.5) 35.43,0.6 arc(37.27,0.69) v1(39.12,0.6)
USB_5V: length 1.9
  Top Layer w0.508: U2.6 arc(12.85,9.39) C17.2
  vias: v1(7.16,11.36) v1(7.14,6.56) v1(7.79,11.36) v1(7.79,6.57) v1(10.96,7.08) v1(11.65,7.09) v1(12.35,7.09)
USB_CC1: length 1.9
  Top Layer w0.178: 7.35,10.23 arc(8.27,10.39) 9.07,10.85
USB_CC2: length 2
  Top Layer w0.178: 9.67,8.18 arc(8.87,7.6) 7.93,7.3
USB_DN: length 17.1
  Top Layer w0.178: USB1.7 v1(8.85,8.73) 8.85,9.06 arc(8.89,9.25) 8.85,9.44 v1(8.85,9.75) USB1.5
  Bottom Layer w0.178: U1.7 20.21,6.17 arc(20.15,6.18) 20.1,6.22 arc(20.06,6.25) 20,6.26 19.63,6.26 arc(18.76,6.54) 18.23,7.29 arc(17.16,8.48) 15.56,8.48 arc(14.65,8.28) 13.73,8.44 arc(11.62,8.98) 9.45,8.97 arc(9.41,8.96) 9.37,8.97 arc(9.09,8.9) v1(8.85,8.73)
USB_DP: length 16.6
  Top Layer w0.178: USB1.8 v1(8.41,8.24) ; USB1.6 arc(7.9,9.24) v1(8.41,9.24)
  Bottom Layer w0.178: v1(8.41,8.24) v1(8.41,9.24) arc(8.8,9.25) 9.18,9.27 arc(9.27,9.29) 9.35,9.3 arc(9.38,9.3) 9.41,9.29 arc(11.66,9.31) 13.85,8.75 arc(14.64,8.61) 15.42,8.78 arc(17.3,8.78) 18.54,7.38 arc(18.96,6.81) 19.63,6.59 20,6.59 arc(20.06,6.6) 20.1,6.63 arc(20.15,6.66) 20.21,6.67 U1.8 ; 8.41,9.26 8.39,9.26
VCORE: length 7.4
  Top Layer w0.508: 28.81,4.92 28.81,4.88 29.19,4.88
  Bottom Layer w0.178: U1.37 arc(29.23,8.56) v1(28.61,8.22) ; U1.12 arc(21.58,8.56) v1(22.31,8.22) ; U1.64 arc(21.75,3) v1(22.19,3.52)
  Bottom Layer w0.381: U1.49 arc(29.06,3.63) v1(28.96,4.92)
VREF_CONN: length 16.7
  Top Layer w0.508: 42.64,12.62 41.13,12.61 ; 41.34,4.74 arc(41.65,4.81) 41.98,4.86 arc(42.3,4.9) 42.63,4.91 ; R20.2 arc(34.28,7.72) 34.9,7.69 arc(35.17,7.68) C30.2 arc(35.38,6.29) Q1.1 ; 34.5,12.55 arc(33.97,12.56) 33.44,12.61 ; 42.48,8.7 arc(42.22,8.7) v1(41.96,8.68) arc(41.82,8.67) 41.68,8.65 ; 33.79,16.57 arc(33.92,16.5) v1(34.05,16.45) arc(34.36,16.37) 34.67,16.34 ; 42.64,16.53 arc(42.31,16.53) 41.97,16.52 arc(41.76,16.51) 41.54,16.5
  Bottom Layer w0.381: 43.17,12.58 arc(43.38,12.06) 43.88,11.82 arc(44.65,11.78) 45.42,11.75
  Bottom Layer w0.508: D7.2 43.12,13.3 41.82,13.3 v1(41.82,12.57)
  vias: v1(34.89,12.59) v1(34.9,7.7) v1(41.97,16.57) v1(41.99,4.78)
$1N3333: length 1.1
  Bottom Layer w0.381: U1.4 arc(20.9,4.67) 21.03,4.68 21.22,4.68 arc(21.29,4.69) 21.36,4.71 arc(21.6,4.74) v1(21.84,4.79)
$1N3334: length 1.2
  Bottom Layer w0.381: U1.9 v1(21.97,7.17)
$1N3341: length 1.5
  Bottom Layer w0.381: v1(22.2,5.94) arc(21.8,5.81) 21.38,5.72 arc(21.31,5.69) 21.22,5.68 21.01,5.68 arc(20.89,5.67) U1.6
$1N3343: length 1.5
  Bottom Layer w0.381: U1.14 22.11,9.67 v1(22.11,9.49)
$1N3540: length 1.6
  Top Layer w0.508: U2.4 arc(11.61,10.04) 11.52,9.76 arc(11.32,9.54) 11.21,9.27 arc(11.07,9.14) R6.1
$1N3543: length 2.5
  Top Layer w0.178: 12.27,12.54 arc(12.06,12.86) 11.73,13.04 arc(11.47,13.02) 11.28,12.84 arc(10.94,12.31) 10.53,11.84
$1N3546: length 12.1
  Top Layer w0.508: U3.3 arc(12.27,16.27) 11.81,16.22 arc(11.6,16.11) 11.5,15.89 arc(11.49,15.3) 11.53,14.72 arc(11.64,14.49) 11.88,14.39 arc(12.24,14.4) 12.59,14.44
  Top Layer w0.762: C16.1 15.75,10.52 arc(16.1,10.67) 16.26,11.02 arc(16.28,12.22) 16.26,13.43 arc(15.81,14.3) C14.1 arc(13.79,14.48) U3.1
$1N7583: length 1.9
  Top Layer w0.508: LED2.2 R8.2
$1N18705: length 1.3
  Top Layer w0.508: 42.78,15.31 arc(42.13,15.37) 41.5,15.55
$1N18713: length 1.4
  Top Layer w0.508: 42.78,3.68 arc(42.06,3.71) 41.36,3.79
$1N18716: length 1.1
  Top Layer w0.508: 42.72,7.46 arc(42.2,7.53) 41.72,7.74
$1N19227: length 1
  Top Layer w0.508: 34.67,11.3 arc(34.2,11.4) 33.8,11.67
$1N19229: length 1.2
  Top Layer w0.508: 34.75,15.08 arc(34.5,15.33) 34.25,15.57 arc(34.02,15.66) 33.79,15.58
$1N19829: length 1.2
  Top Layer w0.508: 42.7,11.39 arc(42.11,11.45) 41.55,11.62
$1N22717: length 1.9
  Top Layer w0.508: LED1.2 R5.1
$1N26100: length 7.4
  Top Layer w0.178: Q1.3 v1(34.42,1.87) ; v1(39.75,0.98) R19.1
  Bottom Layer w0.178: v1(39.75,0.98) arc(37.6,1.2) 35.43,1.11 arc(34.94,1.18) 34.54,1.49 arc(34.45,1.67) v1(34.42,1.87)
$1N26102: length 2.1
  Top Layer w0.508: LED3.1 R19.2

## Copper pours and planes (outline as drawn; the poured copper is in the pictures)
3V3 on Inner2: 35.25,16.7 40.07,16.7 40.07,0.74 35.25,0.74
3V3 on Inner2: 36.1,4.33 46.08,4.33 46.08,0.73 36.1,0.73
3V3 on Inner2: 28.97,16.78 30.64,16.78 30.64,13.74 28.97,13.74
3V3 on Inner2: 42.98,15.72 46.66,15.72 46.66,0.73 42.98,0.73
3V3 on Inner2: 8.76,4.53 8.76,0.73 36.44,0.73 36.44,7.38 33.3,7.38 33.3,14.42 9.75,14.42 9.75,9.3 29.9,9.3 29.9,6.53 28.88,6.53 28.88,5.5 29.89,5.5 29.89,4.72 25.08,4.72 25.08,2.69 20.22,2.69 20.22,3.48 14.44,3.48 14.44,4.53
GND on Top Layer: 0,18 0,0 49.02,0 49.02,18
GND on Bottom Layer: 0,18 0,0 49.02,0 49.02,18
GND on Inner1: 0,18 49.02,18 49.02,0 0,0
USB_5V on Top Layer: 10.65,8.42 13.3,8.42 13.3,6.86 10.65,6.86
USB_5V on Bottom Layer: 6.85,11.63 8,11.63 8,6.24 6.85,6.24
USB_5V on Inner2: 6.81,13.58 6.81,4.61 12.74,4.61 12.74,9.24 9.57,9.24 9.57,13.58 9.18,13.58
VCORE on Inner2: 20.73,9.24 29.76,9.24 29.76,6.58 28.85,6.58 28.85,5.5 29.76,5.5 29.76,4.7 25.05,4.7 25.05,2.82 20.73,2.82 20.73,3.14 20.73,3.14
VREF_CONN on Inner2: 28.45,17.98 33.65,17.98 33.65,16.72 28.45,16.72
VREF_CONN on Inner2: 33.41,17.67 35.15,17.67 35.15,7.48 33.41,7.48
VREF_CONN on Inner2: 40.17,17.73 42.78,17.73 42.78,4.4 40.17,4.4
VREF_CONN on Inner2: 18.18,17.98 28.96,17.98 28.96,14.38 18.18,14.38
VREF_CONN on Inner2: 33.39,17.85 42.72,17.85 42.72,16.71 33.39,16.71

Small or netless copper shapes (teardrops, artwork), in the pictures only: 171 on Top Layer, 57 on Bottom Layer

## Text on the board
Bottom Silkscreen Layer: VREF TX RX GND | JLCJLCJLCJLC | TCK TDO TMS NC TDI | G VREF NC NC G
Top Layer: RF/IMPCAS
Top Silkscreen Layer: TDO | TMS | NC | VREF TX RX GND | RX | TX | VREF | TCK | TDI
